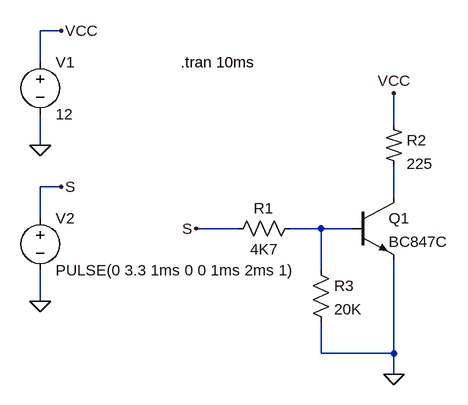
[diagram p0: schematic relay.asc]
relay.asc, the LTspice schematic file:
Version 4
SHEET 1 880 680
WIRE -320 -112 -352 -112
WIRE -352 -64 -352 -112
WIRE 192 32 192 -16
WIRE -352 64 -352 16
WIRE -320 128 -352 128
WIRE 192 144 192 96
WIRE -352 176 -352 128
WIRE -48 192 -112 192
WIRE 80 192 32 192
WIRE 128 192 80 192
WIRE 80 256 80 192
WIRE -352 304 -352 256
WIRE 80 384 80 336
WIRE 192 384 192 240
WIRE 192 384 80 384
WIRE 192 416 192 384
FLAG 192 -16 VCC
FLAG 192 416 0
FLAG -112 192 S
FLAG -320 -112 VCC
FLAG -320 128 S
FLAG -352 64 0
FLAG -352 304 0
SYMBOL npn 128 144 R0
SYMATTR InstName Q1
SYMATTR Value BC847C
SYMBOL res 48 176 R90
WINDOW 0 0 56 VBottom 2
WINDOW 3 32 56 VTop 2
SYMATTR InstName R1
SYMATTR Value 4K7
SYMBOL res2 176 32 R0
SYMATTR InstName R2
SYMATTR Value 225
SYMBOL voltage -352 -80 R0
WINDOW 123 0 0 Left 2
WINDOW 39 0 0 Left 2
SYMATTR InstName V1
SYMATTR Value 12
SYMBOL voltage -352 160 R0
WINDOW 123 0 0 Left 2
WINDOW 39 0 0 Left 2
SYMATTR InstName V2
SYMATTR Value PULSE(0 3.3 1ms 0 0 1ms 2ms 1)
SYMBOL res 64 240 R0
SYMATTR InstName R3
SYMATTR Value 20K
TEXT -136 -64 Left 2 !.tran 10ms

The netlist it stands for:
* relay.asc
Q1 N001 N002 0 0 BC847C
R1 N002 S 4K7
R2 VCC N001 225
V1 VCC 0 12
V2 S 0 PULSE(0 3.3 1ms 0 0 1ms 2ms 1)
R3 N002 0 20K
.model NPN NPN
.model PNP PNP
.lib standard.bjt
.tran 10ms
.backanno
.end